# Altium schematic sheet mdv_commutator.SchDoc
size 410 x 297 mm; PageSetup: Record=PageOptions|CenterHorizontal=True|CenterVertical=True|PrintScale=1.00|XCorrection=1.00|YCorrection=1.00|PrintKind=1|BorderSize=5000000|LeftOffset=0|BottomOffset=0|Orientation=2|PaperLength=1000|PaperWidth=1000|Scale=100|PaperSource=15|PrintQuality=1200|MediaType=1|DitherType=10|PaperKind=A3|PrintScaleMode=1; Weight: -; ScaleFactor: -; NormInspection: Норм.Контр.
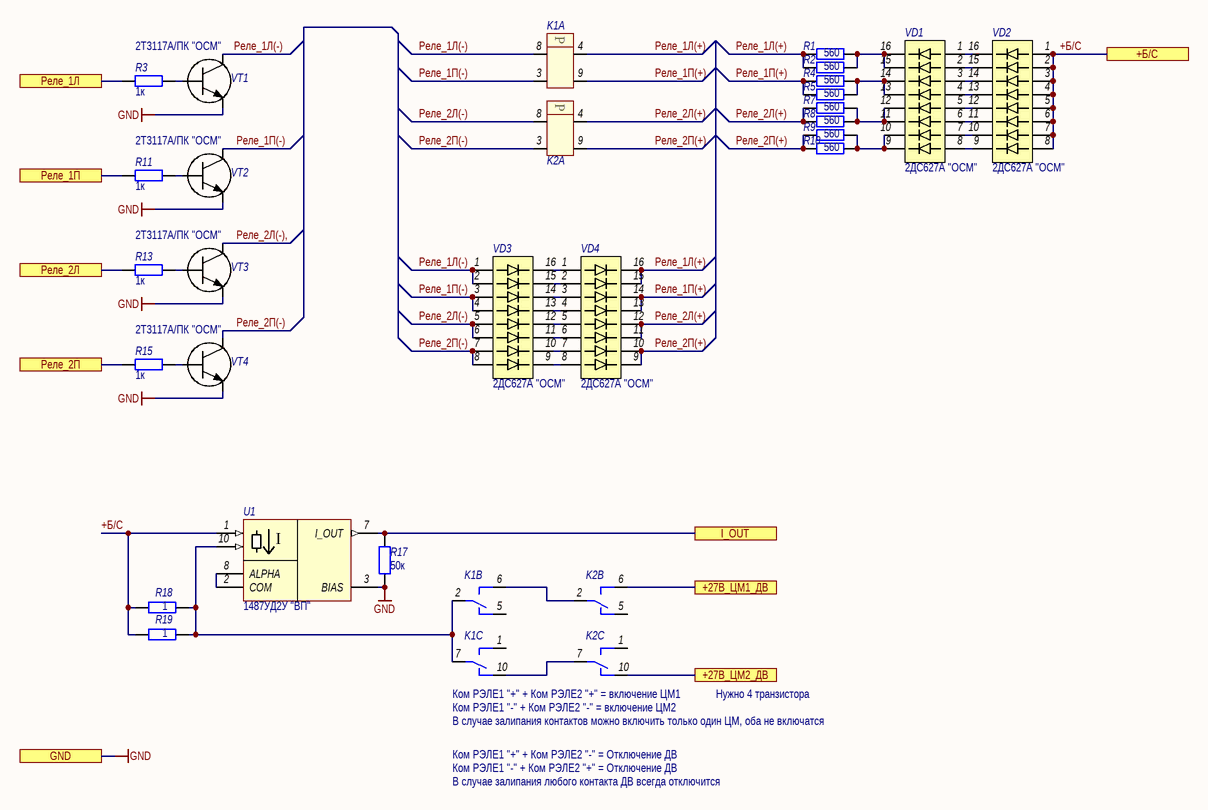
[diagram p0: mdv_commutator.SchDoc]

## Parts
K1  RPS45-1-T-OS  [RPS-45-1]  (value not drawn)  (parts A,B,C of 3)
K2  RPS45-1-T-OS  [RPS-45-1]  (value not drawn)  (parts A,B,C of 3)
R1  560  [SMD_0805]
R2  560  [SMD_0805]
R3  1к  [SMD_0805]
R4  560  [SMD_0805]
R5  560  [SMD_0805]
R7  560  [SMD_0805]
R8  560  [SMD_0805]
R9  560  [SMD_0805]
R10  560  [SMD_0805]
R11  1к  [SMD_0805]
R13  1к  [SMD_0805]
R15  1к  [SMD_0805]
R17  50к  [SMD_0805]
R18  1  [SMD_0805]
R19  1  [SMD_0805]
U1  1487УД2У "ВП"  [FlatPack-10_MSOP-8]
VD1  Наименование: 2ДС627А "ОСМ"  [401.16-3]  (hidden comment: 2DS627A OSM)
VD2  Наименование: 2ДС627А "ОСМ"  [401.16-3]  (hidden comment: 2DS627A OSM)
VD3  Наименование: 2ДС627А "ОСМ"  [401.16-3]  (hidden comment: 2DS627A OSM)
VD4  Наименование: 2ДС627А "ОСМ"  [401.16-3]  (hidden comment: 2DS627A OSM)
VT1  Наименование: 2Т3117А/ПК "ОСМ"  [TO-18]  (hidden comment: 2T3117A)
VT2  Наименование: 2Т3117А/ПК "ОСМ"  [TO-18]  (hidden comment: 2T3117A)
VT3  Наименование: 2Т3117А/ПК "ОСМ"  [TO-18]  (hidden comment: 2T3117A)
VT4  Наименование: 2Т3117А/ПК "ОСМ"  [TO-18]  (hidden comment: 2T3117A)

## Ports
+27В_ЦМ1_ДВ, +27В_ЦМ2_ДВ, +Б/С, GND, I_OUT, Реле_1Л, Реле_1П, Реле_2Л, Реле_2П

## Nets
GND: R17.1 U1.3(BIAS) VT1.1(EMITTER) VT2.1(EMITTER) VT3.1(EMITTER) VT4.1(EMITTER) ; port GND
+27В_ЦМ1_ДВ: K2.6 ; port +27В_ЦМ1_ДВ
+27В_ЦМ2_ДВ: K2.10 ; port +27В_ЦМ2_ДВ
+Б/С: R18.2 R19.2 U1.1(V+) VD2.1(1A) VD2.2(1B) VD2.3(1C) VD2.4(1D) VD2.5(1E) VD2.6(1F) VD2.7(1G) VD2.8(1H) ; port +Б/С
I_OUT: R17.2 U1.7(I_OUT) ; port I_OUT
Реле_1Л: R3.1 ; port Реле_1Л
Реле_1Л(+): K1.4 R1.1 R2.1 VD4.15(2B) VD4.16(2A)
Реле_1Л(-): K1.8 VD3.1(1A) VD3.2(1B) VT1.3(COLLECTOR)
Реле_1П: R11.1 ; port Реле_1П
Реле_1П(+): K1.9 R4.1 R5.1 VD4.13(2D) VD4.14(2C)
Реле_1П(-): K1.3 VD3.3(1C) VD3.4(1D) VT2.3(COLLECTOR)
Реле_2Л: R13.1 ; port Реле_2Л
Реле_2Л(+): K2.4 R7.1 R8.1 VD4.11(2F) VD4.12(2E)
Реле_2Л(-): K2.8 VD3.5(1E) VD3.6(1F)
Реле_2Л(-),: VT3.3(COLLECTOR)
Реле_2П: R15.1 ; port Реле_2П
Реле_2П(+): K2.9 R9.1 R10.1 VD4.9(2G) VD4.10(2G)
Реле_2П(-): K2.3 VD3.7(1G) VD3.8(1H) VT4.3(COLLECTOR)
NetK1_2: K1.2 K1.7 R18.1 R19.1 U1.10(V_SENSE)
NetK1_6: K1.6 K2.2
NetK1_10: K1.10 K2.7
NetR1_2: R1.2 R2.2 VD1.15(2B) VD1.16(2A)
NetR3_2: R3.2 VT1.2(BASE)
NetR4_2: R4.2 R5.2 VD1.13(2D) VD1.14(2C)
NetR7_2: R7.2 R8.2 VD1.11(2F) VD1.12(2E)
NetR9_2: R9.2 R10.2 VD1.9(2G) VD1.10(2G)
NetR11_2: R11.2 VT2.2(BASE)
NetR13_2: R13.2 VT3.2(BASE)
NetR15_2: R15.2 VT4.2(BASE)
NetU1_2: U1.2(COM) U1.8(ALPHA)
NetVD1_1: VD1.1(1A) VD2.16(2A)
NetVD1_2: VD1.2(1B) VD2.15(2B)
NetVD1_3: VD1.3(1C) VD2.14(2C)
NetVD1_4: VD1.4(1D) VD2.13(2D)
NetVD1_5: VD1.5(1E) VD2.12(2E)
NetVD1_6: VD1.6(1F) VD2.11(2F)
NetVD1_7: VD1.7(1G) VD2.10(2G)
NetVD1_8: VD1.8(1H) VD2.9(2G)
NetVD3_9: VD3.9(2G) VD4.8(1H)
NetVD3_10: VD3.10(2G) VD4.7(1G)
NetVD3_11: VD3.11(2F) VD4.6(1F)
NetVD3_12: VD3.12(2E) VD4.5(1E)
NetVD3_13: VD3.13(2D) VD4.4(1D)
NetVD3_14: VD3.14(2C) VD4.3(1C)
NetVD3_15: VD3.15(2B) VD4.2(1B)
NetVD3_16: VD3.16(2A) VD4.1(1A)

Not connected (* = marked no-connect by the designer): K1 1 5; K2 1 5

## Notes on the sheet
- Ком РЭЛЕ1 "+" + Ком РЭЛЕ2 "+" = включение ЦМ1
- Нужно 4 транзистора
- Ком РЭЛЕ1 "-" + Ком РЭЛЕ2 "-" = включение ЦМ2
- Ком РЭЛЕ1 "+" + Ком РЭЛЕ2 "-" = Отключение ДВ
- Ком РЭЛЕ1 "-" + Ком РЭЛЕ2 "+" = Отключение ДВ
- В случае залипания контактов можно включить только один ЦМ, оба не включатся
- В случае залипания любого контакта ДВ всегда отключится
- Подп. и дата
- Инв. № дубл.
- Взам. инв. №
- Инв. № подл.
- Изм.
- Лист
- № докум.
- Подп.
- Дата
- Форма 2а ГОСТ 2.104-2006
- Копировал
- Формат А3
- (in symbol AD8212S) I
- (in symbol RPS45, part A) P

## Library data of the parts
K1 K2 = RPS45: Реле поляризованное; Потребление, Вт: 0,000; Наименование: РПС45-1-Т-ОС РС4.520.756-11; Назначение: Реле поляризованное; ComponentLink1Description: DataSheet; ComponentLink1URL: https://relays.ru/files/catalog/rps45.pdf
R1-R5 R7-R11 R13 R15 = Resistor: Наименование: Резистор; Назначение: SMD-резистор; Потребление, Вт: 0,001
  R1 R2 R4 R5 R7-R10: Value: 560
  R3 R11 R13 R15: Value: 1к
R17-R19 = Resistor: Наименование: Р1-12-0.125 ОСМ; Назначение: SMD-резистор; Потребление, Вт: 0,001
  R17: Value: 50к
  R18 R19: Value: 1
U1 = AD8212S: Назначение: Токовый датчик; Наименование: 1487УД2У "ВП"
VD1-VD4 = 2DS627A: Диодная матрица; Потребление, Вт: 0,0; Назначение: Диодная матрица; ComponentLink1Description: DataSheet; ComponentLink1URL: https://www.integral.by/sites/default/files/pdf/2ds627a.pdf
VT1-VT4 = 2T3117A: Кремниевый биполярный / эпитаксиально-планарный / n-p-n транзистор; Назначение: Биполярный транзистор; Потребление, Вт: 0,0; ComponentLink1Description: DataSheet; ComponentLink1URL: https://www.integral.by/sites/default/files/pdf/2t3117.pdf